# Altium schematic sheet trafficlight.SchDoc
size A4
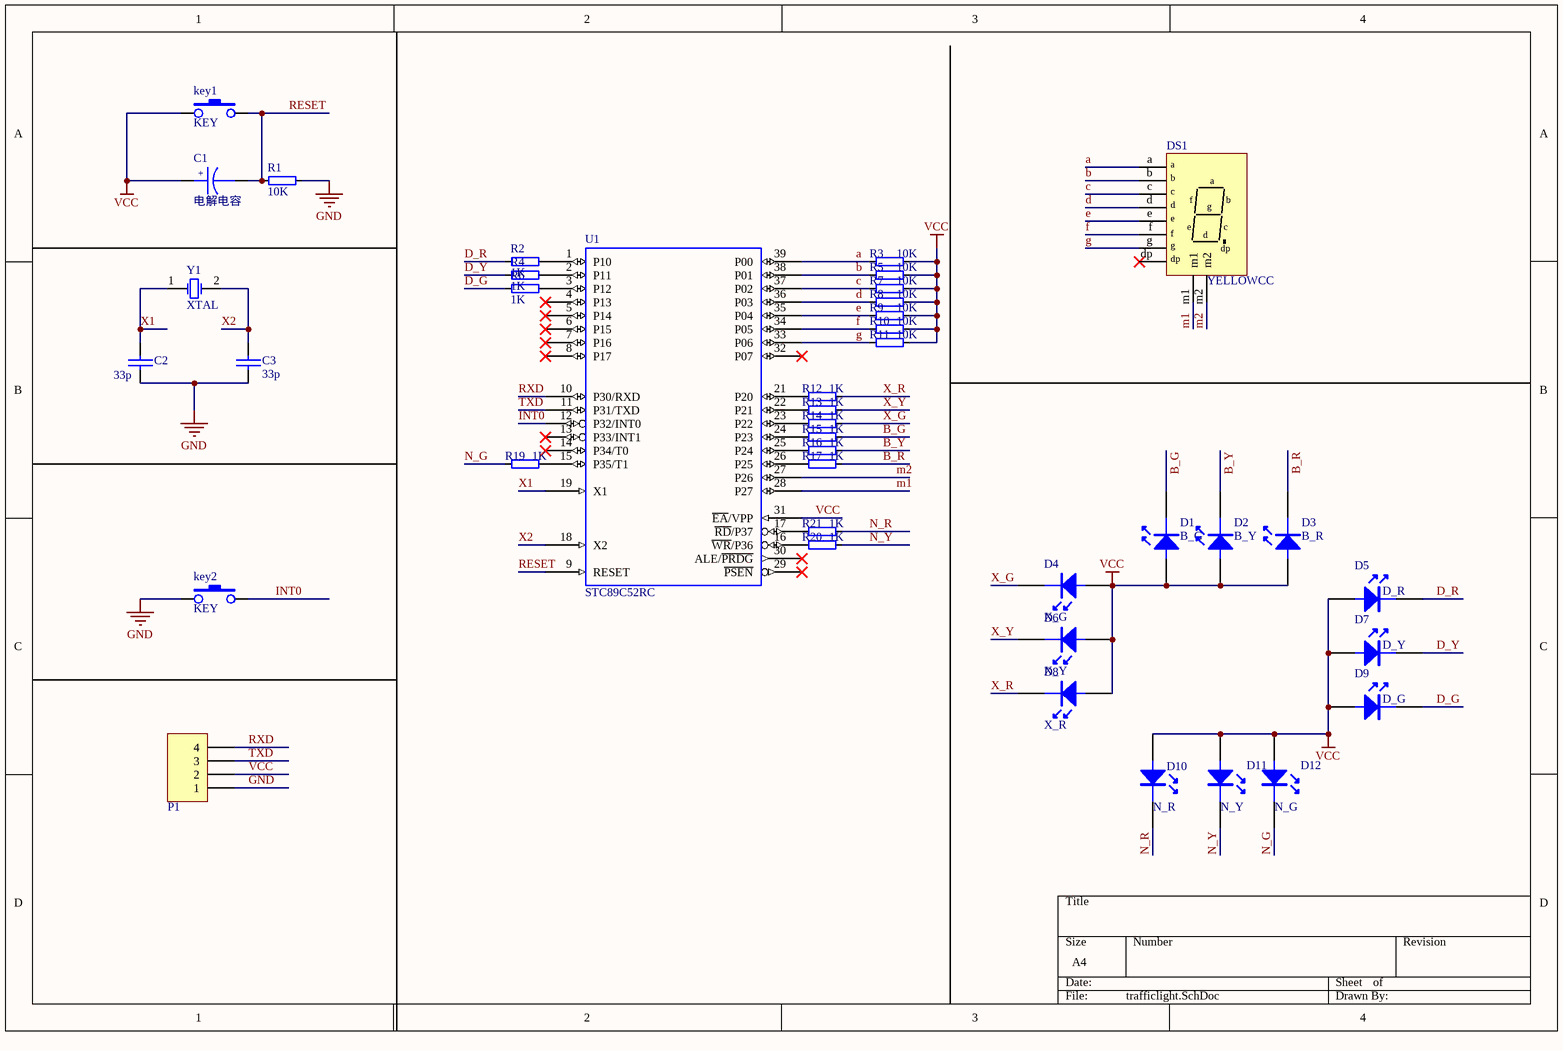
[diagram p0: trafficlight.SchDoc]

## Parts
C1  电解电容  [D50V10UF]
C2  33p  [D104]
C3  33p  [D104]
D1  B_G  [LED]
D2  B_Y  [LED]
D3  B_R  [LED]
D4  X_G  [LED]
D5  D_R  [LED]
D6  X_Y  [LED]
D7  D_Y  [LED]
D8  X_R  [LED]
D9  D_G  [LED]
D10  N_R  [LED]
D11  N_Y  [LED]
D12  N_G  [LED]
DS1  YELLOWCC  [0.5INCH-DISP]
key1  KEY  [6X6X?]
key2  KEY  [6X6X?]
P1  Header 4  [SIP4]  (value not drawn)
R1  10K  [AXIAL0.4]
R2  1K  [AXIAL0.4]
R3  10K  [AXIAL0.4]
R4  1K  [AXIAL0.4]
R5  10K  [AXIAL0.4]
R6  1K  [AXIAL0.4]
R7  10K  [AXIAL0.4]
R8  10K  [AXIAL0.4]
R9  10K  [AXIAL0.4]
R10  10K  [AXIAL0.4]
R11  10K  [AXIAL0.4]
R12  1K  [AXIAL0.4]
R13  1K  [AXIAL0.4]
R14  1K  [AXIAL0.4]
R15  1K  [AXIAL0.4]
R16  1K  [AXIAL0.4]
R17  1K  [AXIAL0.4]
R19  1K  [AXIAL0.4]
R20  1K  [AXIAL0.4]
R21  1K  [AXIAL0.4]
U1  STC89C52RC  [DIP40C]
Y1  XTAL  [晶振]

## Nets
GND: C2.2 C3.2 key2.1 P1.1 R1.2 U1.20(GND)
VCC: C1.1 D1.1 D2.1 D3.1 D4.1 D5.1 D6.1 D7.1 D8.1 D9.1 D10.1 D11.1 D12.1 key1.1 P1.2 R3.2 R5.2 R7.2 R8.2 R9.2 R10.2 R11.2 U1.31(~{EA}/VPP) U1.40(VCC)
a: DS1.a R3.1 U1.39(P00)
b: DS1.b R5.1 U1.38(P01)
B_G: D1.2 R15.2
B_R: D3.2 R17.2
B_Y: D2.2 R16.2
c: DS1.c R7.1 U1.37(P02)
d: DS1.d R8.1 U1.36(P03)
D_G: D9.2 R6.2
D_R: D5.2 R2.2
D_Y: D7.2 R4.2
e: DS1.e R9.1 U1.35(P04)
f: DS1.f R10.1 U1.34(P05)
g: DS1.g R11.1 U1.33(P06)
INT0: key2.2 U1.12(P32/INT0)
m1: DS1.m1 U1.28(P27)
m2: DS1.m2 U1.27(P26)
N_G: D12.2 R19.1
N_R: D10.2 R21.2
N_Y: D11.2 R20.2
RESET: C1.2 key1.2 R1.1 U1.9(RESET)
RXD: P1.4 U1.10(P30/RXD)
TXD: P1.3 U1.11(P31/TXD)
X1: C2.1 U1.19(X1) Y1.1
X2: C3.1 U1.18(X2) Y1.2
X_G: D4.2 R14.2
X_R: D8.2 R12.2
X_Y: D6.2 R13.2
NetR2_1: R2.1 U1.1(P10)
NetR4_1: R4.1 U1.2(P11)
NetR6_1: R6.1 U1.3(P12)
NetR12_1: R12.1 U1.21(P20)
NetR13_1: R13.1 U1.22(P21)
NetR14_1: R14.1 U1.23(P22)
NetR15_1: R15.1 U1.24(P23)
NetR16_1: R16.1 U1.25(P24)
NetR17_1: R17.1 U1.26(P25)
NetR19_2: R19.2 U1.15(P35/T1)
NetR20_1: R20.1 U1.16(~{WR}/P36)
NetR21_1: R21.1 U1.17(~{RD}/P37)

Not connected (* = marked no-connect by the designer): DS1 dp*; U1 4(P13)* 5(P14)* 6(P15)* 7(P16)* 8(P17)* 13(P33/INT1)* 14(P34/T0)* 29(~{PSEN})* 30(ALE/~{PRDG})* 32(P07)*

## Notes on the sheet
- (in symbol 电解电容) +

## Library data of the parts
C1 = 电解电容: Capacitor
C2 C3 = 普通电容: Capacitor
D1-D12 = LED
DS1 = YELLOWCC: Common Cathhode Seven-Segment Display, Right Hand Decimal
P1 = Header 4: Header, 4-Pin; LatestRevisionDate: 17-Jul-2002; LatestRevisionNote: Re-released for DXP Platform.; Publisher: Altium Limited
R1-R17 R19-R21 = RES
U1 = AT89C51
Y1 = XTAL: XTAL: 12MHZ